# EAGLE schematic rokit (EAGLE 6.4)
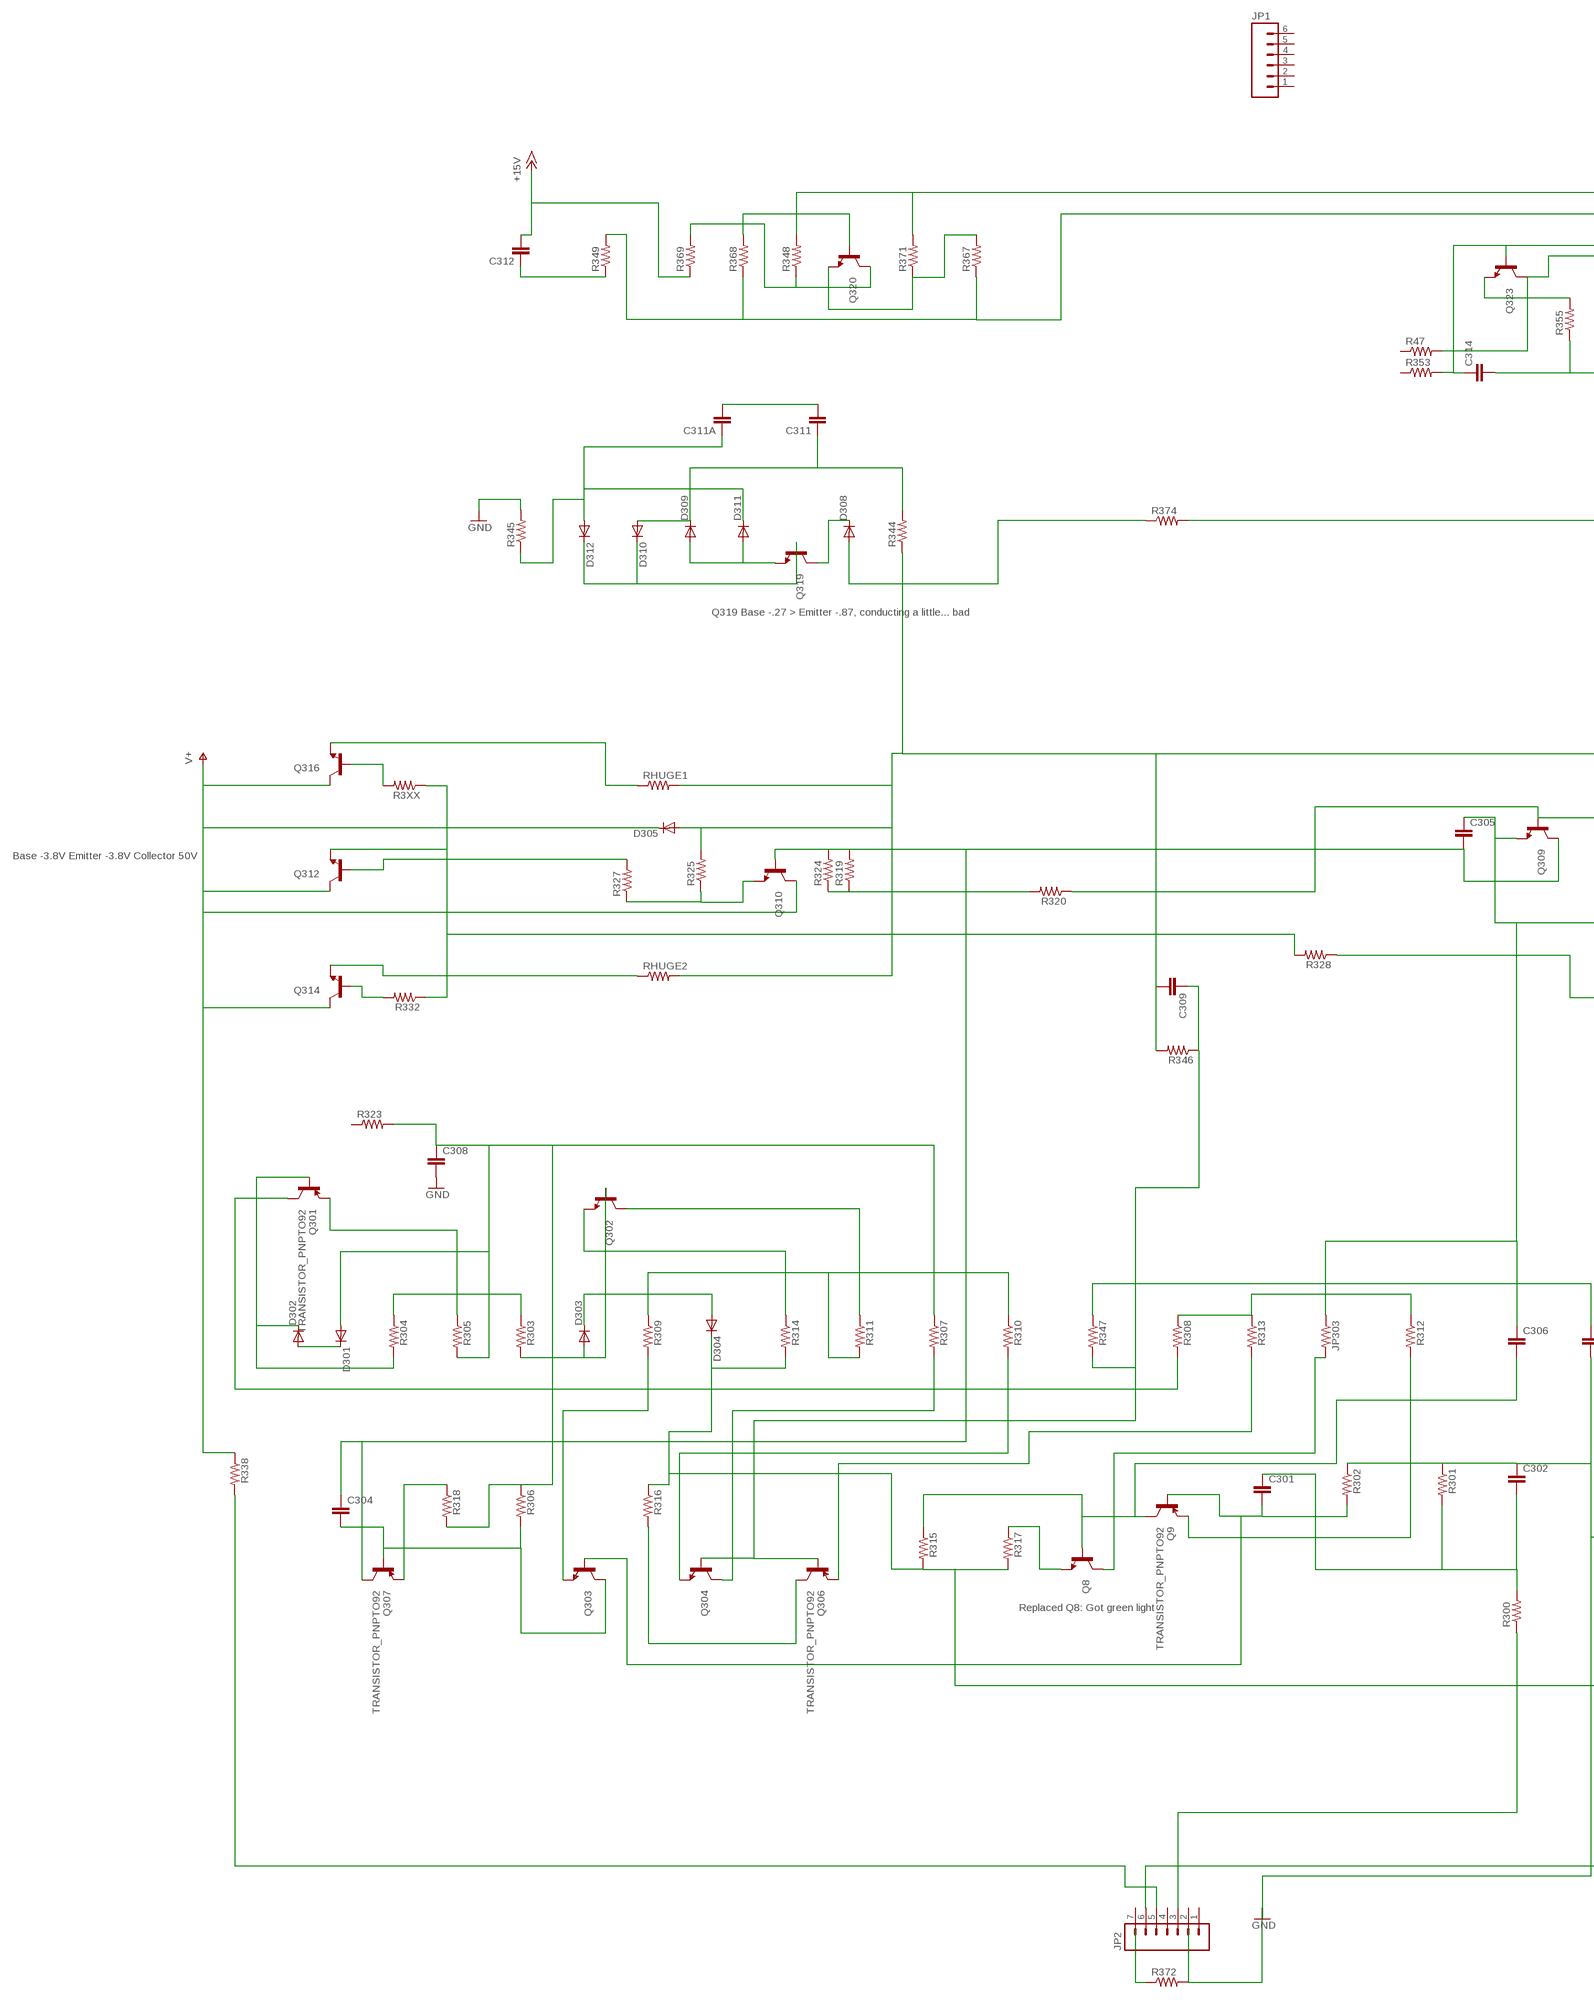
[diagram p0: schematic, sheet 1, part 1 of 2]
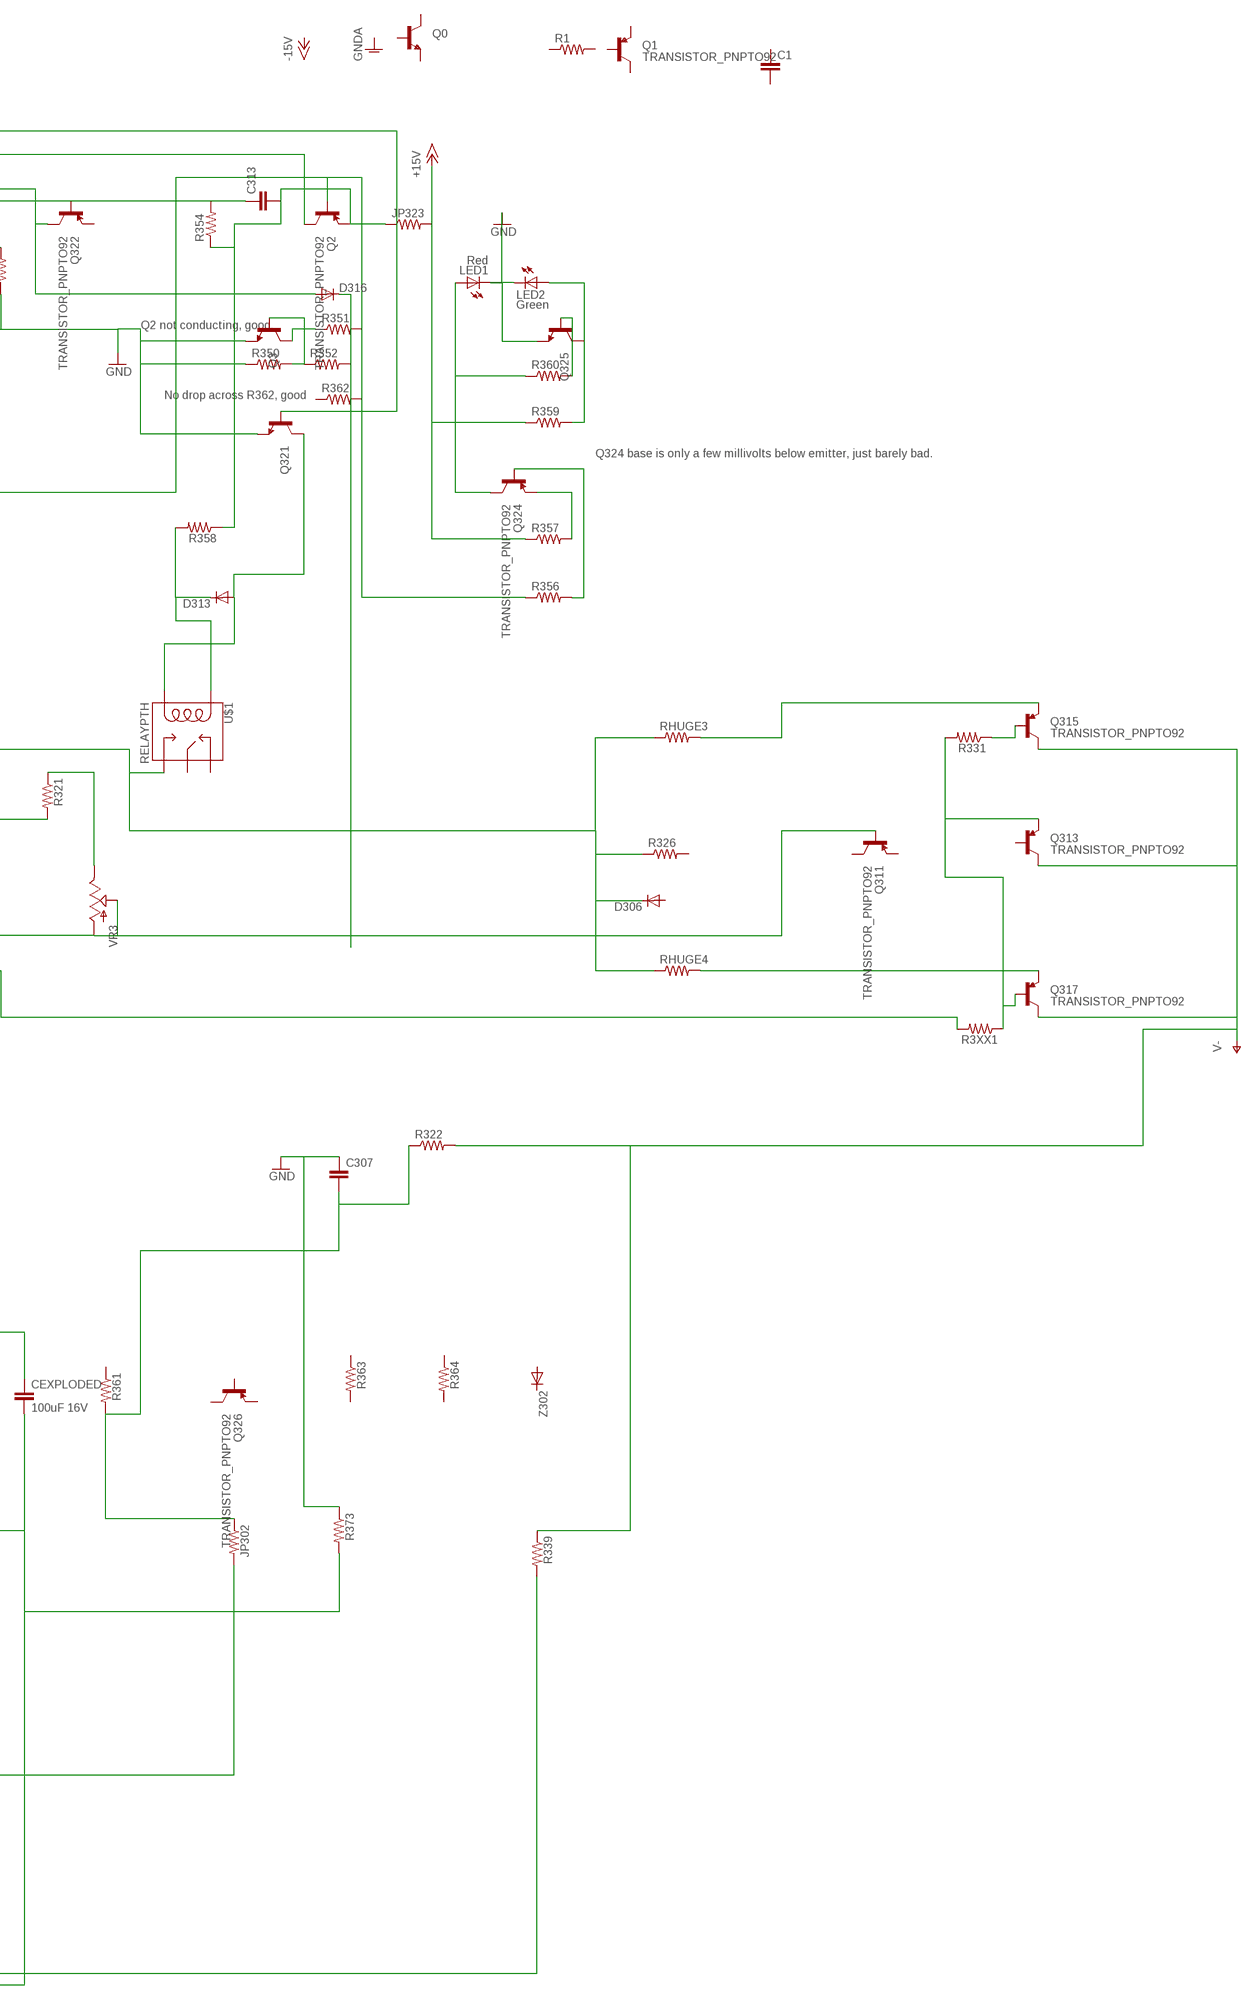
[diagram p1: schematic, sheet 1, part 2 of 2]

## Parts
C1  CAPPTH  [CAP-PTH-SMALL]
C301  CAPPTH  [CAP-PTH-SMALL]
C302  CAPPTH  [CAP-PTH-SMALL]
C304  CAPPTH  [CAP-PTH-SMALL]
C305  CAPPTH  [CAP-PTH-SMALL]
C306  CAPPTH  [CAP-PTH-SMALL]
C307  CAPPTH  [CAP-PTH-SMALL]
C308  CAPPTH  [CAP-PTH-SMALL]
C309  CAPPTH  [CAP-PTH-SMALL]
C311  CAPPTH  [CAP-PTH-SMALL]
C311A  CAPPTH  [CAP-PTH-SMALL]
C312  CAPPTH  [CAP-PTH-SMALL]
C313  CAPPTH  [CAP-PTH-SMALL]
C314  CAPPTH  [CAP-PTH-SMALL]
CEXPLODED  100uF 16V  CAPPTH  [CAP-PTH-SMALL]
D301  DIODE1N4148  [DIODE-1N4148]
D302  DIODE1N4148  [DIODE-1N4148]
D303  DIODE1N4148  [DIODE-1N4148]
D304  DIODE1N4148  [DIODE-1N4148]
D305  DIODE1N4148  [DIODE-1N4148]
D306  DIODE1N4148  [DIODE-1N4148]
D308  DIODE1N4148  [DIODE-1N4148]
D309  DIODE1N4148  [DIODE-1N4148]
D310  DIODE1N4148  [DIODE-1N4148]
D311  DIODE1N4148  [DIODE-1N4148]
D312  DIODE1N4148  [DIODE-1N4148]
D313  DIODE1N4148  [DIODE-1N4148]
D316  DIODE1N4148  [DIODE-1N4148]
JP1  M06LONGPADS  [1X06_LONGPADS]
JP2  M07  [1X07]
JP302  RESISTORPTH-1/4W  [AXIAL-0.4]
JP303  RESISTORPTH-1/4W  [AXIAL-0.4]
JP323  RESISTORPTH-1/4W  [AXIAL-0.4]
LED1  Red  LED5MM  [LED5MM]
LED2  Green  LED5MM  [LED5MM]
Q0  TRANSISTOR_NPNTO92  [TO-92]
Q1  TRANSISTOR_PNPTO92  [TO-92]
Q2  TRANSISTOR_PNPTO92  [TO-92]
Q3  TRANSISTOR_NPNTO92  [TO-92]
Q8  TRANSISTOR_NPNTO92  [TO-92]
Q9  TRANSISTOR_PNPTO92  [TO-92]
Q301  TRANSISTOR_PNPTO92  [TO-92]
Q302  TRANSISTOR_NPNTO92  [TO-92]
Q303  TRANSISTOR_NPNTO92  [TO-92]
Q304  TRANSISTOR_NPNTO92  [TO-92]
Q306  TRANSISTOR_PNPTO92  [TO-92]
Q307  TRANSISTOR_PNPTO92  [TO-92]
Q309  TRANSISTOR_NPNTO92  [TO-92]
Q310  TRANSISTOR_NPNTO92  [TO-92]
Q311  TRANSISTOR_PNPTO92  [TO-92]
Q312  TRANSISTOR_NPNTO92  [TO-92]
Q313  TRANSISTOR_PNPTO92  [TO-92]
Q314  TRANSISTOR_NPNTO92  [TO-92]
Q315  TRANSISTOR_PNPTO92  [TO-92]
Q316  TRANSISTOR_NPNTO92  [TO-92]
Q317  TRANSISTOR_PNPTO92  [TO-92]
Q319  TRANSISTOR_NPNTO92  [TO-92]
Q320  TRANSISTOR_NPNTO92  [TO-92]
Q321  TRANSISTOR_NPNTO92  [TO-92]
Q322  TRANSISTOR_PNPTO92  [TO-92]
Q323  TRANSISTOR_NPNTO92  [TO-92]
Q324  TRANSISTOR_PNPTO92  [TO-92]
Q325  TRANSISTOR_NPNTO92  [TO-92]
Q326  TRANSISTOR_PNPTO92  [TO-92]
R1  RESISTORPTH-1/4W  [AXIAL-0.4]
R3XX  RESISTORPTH-1/4W  [AXIAL-0.4]
R3XX1  RESISTORPTH-1/4W  [AXIAL-0.4]
R47  RESISTORPTH-1/4W  [AXIAL-0.4]
R300  RESISTORPTH-1/4W  [AXIAL-0.4]
R301  RESISTORPTH-1/4W  [AXIAL-0.4]
R302  RESISTORPTH-1/4W  [AXIAL-0.4]
R303  RESISTORPTH-1/4W  [AXIAL-0.4]
R304  RESISTORPTH-1/4W  [AXIAL-0.4]
R305  RESISTORPTH-1/4W  [AXIAL-0.4]
R306  RESISTORPTH-1/4W  [AXIAL-0.4]
R307  RESISTORPTH-1/4W  [AXIAL-0.4]
R308  RESISTORPTH-1/4W  [AXIAL-0.4]
R309  RESISTORPTH-1/4W  [AXIAL-0.4]
R310  RESISTORPTH-1/4W  [AXIAL-0.4]
R311  RESISTORPTH-1/4W  [AXIAL-0.4]
R312  RESISTORPTH-1/4W  [AXIAL-0.4]
R313  RESISTORPTH-1/4W  [AXIAL-0.4]
R314  RESISTORPTH-1/4W  [AXIAL-0.4]
R315  RESISTORPTH-1/4W  [AXIAL-0.4]
R316  RESISTORPTH-1/4W  [AXIAL-0.4]
R317  RESISTORPTH-1/4W  [AXIAL-0.4]
R318  RESISTORPTH-1/4W  [AXIAL-0.4]
R319  RESISTORPTH-1/4W  [AXIAL-0.4]
R320  RESISTORPTH-1/4W  [AXIAL-0.4]
R321  RESISTORPTH-1/4W  [AXIAL-0.4]
R322  RESISTORPTH-1/4W  [AXIAL-0.4]
R323  RESISTORPTH-1/4W  [AXIAL-0.4]
R324  RESISTORPTH-1/4W  [AXIAL-0.4]
R325  RESISTORPTH-1/4W  [AXIAL-0.4]
R326  RESISTORPTH-1/4W  [AXIAL-0.4]
R327  RESISTORPTH-1/4W  [AXIAL-0.4]
R328  RESISTORPTH-1/4W  [AXIAL-0.4]
R331  RESISTORPTH-1/4W  [AXIAL-0.4]
R332  RESISTORPTH-1/4W  [AXIAL-0.4]
R338  RESISTORPTH-1/4W  [AXIAL-0.4]
R339  RESISTORPTH-1/4W  [AXIAL-0.4]
R344  RESISTORPTH-1/4W  [AXIAL-0.4]
R345  RESISTORPTH-1/4W  [AXIAL-0.4]
R346  RESISTORPTH-1/4W  [AXIAL-0.4]
R347  RESISTORPTH-1/4W  [AXIAL-0.4]
R348  RESISTORPTH-1/4W  [AXIAL-0.4]
R349  RESISTORPTH-1/4W  [AXIAL-0.4]
R350  RESISTORPTH-1/4W  [AXIAL-0.4]
R351  RESISTORPTH-1/4W  [AXIAL-0.4]
R352  RESISTORPTH-1/4W  [AXIAL-0.4]
R353  RESISTORPTH-1/4W  [AXIAL-0.4]
R354  RESISTORPTH-1/4W  [AXIAL-0.4]
R355  RESISTORPTH-1/4W  [AXIAL-0.4]
R356  RESISTORPTH-1/4W  [AXIAL-0.4]
R357  RESISTORPTH-1/4W  [AXIAL-0.4]
R358  RESISTORPTH-1/4W  [AXIAL-0.4]
R359  RESISTORPTH-1/4W  [AXIAL-0.4]
R360  RESISTORPTH-1/4W  [AXIAL-0.4]
R361  RESISTORPTH-1/4W  [AXIAL-0.4]
R362  RESISTORPTH-1/4W  [AXIAL-0.4]
R363  RESISTORPTH-1/4W  [AXIAL-0.4]
R364  RESISTORPTH-1/4W  [AXIAL-0.4]
R367  RESISTORPTH-1/4W  [AXIAL-0.4]
R368  RESISTORPTH-1/4W  [AXIAL-0.4]
R369  RESISTORPTH-1/4W  [AXIAL-0.4]
R371  RESISTORPTH-1/4W  [AXIAL-0.4]
R372  RESISTORPTH-1/4W  [AXIAL-0.4]
R373  RESISTORPTH-1/4W  [AXIAL-0.4]
R374  RESISTORPTH-1/4W  [AXIAL-0.4]
RHUGE1  RESISTORPTH-1/4W  [AXIAL-0.4]
RHUGE2  RESISTORPTH-1/4W  [AXIAL-0.4]
RHUGE3  RESISTORPTH-1/4W  [AXIAL-0.4]
RHUGE4  RESISTORPTH-1/4W  [AXIAL-0.4]
U$1  RELAYPTH  [RELAY-G5Q]
VR3  POTTRIM  [TRIM_POT]
Z302  DIODE1N4148  [DIODE-1N4148]

## Nets
+15V: C312.2 JP323.P$2 R357.P$1 R359.P$1 R369.P$1
GND: C302.1 C307.1 C308.2 C314.2 CEXPLODED.2 LED1.K(C) LED2.K(C) Q3.1(E) Q321.1(E) Q325.1(E) R301.P$1 R302.P$1 R345.P$2 R350.P$1 R355.P$1 R372.P$2 R373.P$1 R373.P$2
N$1: LED2.A Q325.3(C) R359.P$2
N$2: Q325.2(B) R360.P$2
N$3: LED1.A Q324.3(C) R360.P$1
N$4: Q324.1(E) R357.P$2
N$5: Q324.2(B) R356.P$2
N$6: Q2.2(B) R351.P$2 R356.P$1 R362.P$2 R374.P$2
N$7: C313.2 JP323.P$1 Q2.1(E) R354.P$1 R358.P$1
N$8: C313.1 Q322.2(B) Q323.3(C) R47.P$2 R354.P$2
N$9: C314.1 D316.A Q322.3(C) Q323.2(B) R353.P$2
N$10: Q2.3(C) R349.P$2 R367.P$1 R368.P$1
N$11: D308.A R374.P$1
N$12: D308.C Q319.3(C)
N$13: D309.A D311.A Q319.1(E)
N$14: D310.C D312.C Q319.2(B)
N$15: C311A.1 D311.C D312.A R345.P$1
N$16: Q3.3(C) R351.P$1
N$17: C311.2 C311A.2
N$18: Q3.2(B) R350.P$2 R352.P$1
N$19: C311.1 D309.C D310.A R344.P$2
N$20: D316.C R352.P$2
N$21: Q323.1(E) R355.P$2
N$22: D313.A Q321.3(C) U$1.1(COIL2)
N$23: D313.C R358.P$2 U$1.5(COIL1)
N$24: Q321.2(B) R348.P$2 R371.P$2
N$25: Q320.3(C) R348.P$1 R369.P$2
N$26: Q320.2(B) R368.P$2
N$27: C312.1 R349.P$1
N$28: Q320.1(E) R367.P$2 R371.P$1
N$29: C309.2 D305.A D306.C R325.P$2 R326.P$1 R344.P$1 R346.P$2 RHUGE1.P$2 RHUGE2.P$2 RHUGE3.P$1 RHUGE4.P$1 U$1.3(NO)
N$30: C309.1 Q304.2(B) Q306.2(B) R346.P$1 R347.P$2
N$31: CEXPLODED.1 R347.P$1
N$32: R372.P$1
N$33: Q304.3(C) R307.P$2
N$34: D302.C Q301.2(B) R304.P$2
N$35: C308.1 D301.A R305.P$2 R306.P$1 R307.P$1 R318.P$2 R323.P$2
N$36: R303.P$1 R304.P$1
N$37: D301.C D302.A
N$38: Q301.1(E) R305.P$1
N$39: D303.A Q302.2(B) R303.P$2
N$40: D303.C D304.A
N$41: Q301.3(C) R308.P$2
N$42: Q316.1(E) RHUGE1.P$1
N$43: Q314.1(E) RHUGE2.P$1
N$44: Q315.1(E) RHUGE3.P$2
N$45: Q317.1(E) RHUGE4.P$2
N$46: Q316.2(B) R3XX.P$2
N$47: Q312.1(E) R3XX.P$1 R328.P$2 R332.P$1
N$48: Q314.2(B) R332.P$2
N$49: R3XX1.P$2 R328.P$1
N$50: Q313.1(E) Q317.2(B) R3XX1.P$1 R331.P$2
N$51: Q315.2(B) R331.P$1
N$52: Q310.1(E) R325.P$1 R327.P$1
N$53: Q312.2(B) R327.P$2
N$54: C304.1 C305.2 Q307.3(C) Q309.3(C) Q310.2(B) R319.P$2 R324.P$2
N$55: R319.P$1 R320.P$2 R324.P$1
N$56: Q309.2(B) R320.P$1 R321.P$2
N$57: C306.2 Q8.2(B) Q9.3(C) R315.P$1
N$59: R321.P$1 VR3.2(E)
N$60: C304.2 Q303.3(C) Q307.2(B) R306.P$2
N$61: Q307.1(E) R318.P$1
N$62: Q303.1(E) R309.P$2
N$63: C301.2 Q9.2(B) Q303.2(B) R302.P$2
N$64: Q306.3(C) R316.P$2
N$65: Q304.1(E) R310.P$2
N$66: D304.C JP302.P$2 R314.P$2 R315.P$2 R316.P$1 R317.P$2
N$67: Q8.1(E) R317.P$1
N$68: JP303.P$2 Q8.3(C)
N$69: Q9.1(E) R312.P$2
N$70: Q306.1(E) R313.P$2
N$71: C301.1 C302.2 R300.P$2 R301.P$2
N$72: JP2.3 R300.P$1
N$73: C307.2 JP302.P$1 R322.P$1 R361.P$2
N$74: JP2.6 R339.P$2
N$75: JP2.5 R338.P$2
N$76: R309.P$1 R310.P$1 R311.P$2
N$77: Q302.1(E) R314.P$1
N$78: Q302.3(C) R311.P$1
N$79: R308.P$1 R312.P$1 R313.P$1
N$80: C305.1 C306.1 JP303.P$1 Q309.1(E) Q311.2(B) VR3.1(S) VR3.3(A)
V+: D305.C Q310.3(C) Q312.3(C) Q314.3(C) Q316.3(C) R338.P$1
V-: Q313.3(C) Q315.3(C) Q317.3(C) R322.P$2 R339.P$1
Unconnected: C1.1 C1.2 D306.A JP1.1 JP1.2 JP1.3 JP1.4 JP1.5 JP1.6 JP2.1 JP2.2 JP2.4 JP2.7 Q0.1(E) Q0.2(B) Q0.3(C) Q1.1(E) Q1.2(B) Q1.3(C) Q311.1(E) Q311.3(C) Q313.2(B) Q322.1(E) Q326.1(E) Q326.2(B) Q326.3(C) R1.P$1 R1.P$2 R47.P$1 R323.P$1 R326.P$2 R353.P$1 R361.P$1 R362.P$1 R363.P$1 R363.P$2 R364.P$1 R364.P$2 U$1.2(MAIN) U$1.4(NC) Z302.A Z302.C

## Notes on the sheet
- Q2 not conducting, good.
- No drop across R362, good
- Q324 base is only a few millivolts below emitter, just barely bad.
- Q319 Base -.27 > Emitter -.87, conducting a little... bad
- Base -3.8V Emitter -3.8V Collector 50V
- Replaced Q8: Got green light

## Library data of the parts
C1 C301 C302 C304-C309 C311 C311A C312-C314 CEXPLODED = SparkFun:CAP: Capacitor Standard 0603 ceramic capacitor, and 0.1" leaded capacitor.
D301-D306 D308-D313 D316 Z302 = SparkFun:DIODE: Diode These are standard reverse protection diodes and small signal diodes. SMA package can handle up to about 1A. SOD-323 can handle about 200mA. What the SOD-323 package when ordering, there are some mfgs out there that are 5-pin packages.
JP1 = SparkFun:M06: Header 6 Standard 6-pin 0.1" header. Use with straight break away headers (SKU : PRT-00116), right angle break away headers (PRT-00553), swiss pins (PRT-00743), machine pins (PRT-00117), and female headers (PRT-00115). Molex polarized connector foot print use with SKU : PRT-08094 with associated crimp pins and housings. NOTES ON THE VARIANTS LOCK and LOCK_LONGPADS... This footprint was designed to help hold the alignment of a through-hole component (i.e. 6-pin header) while soldering it into place. You may notice that each hole has been shifted either up or down by 0.005 of an inch from it's more standard position (which is a perfectly straight line). This slight alteration caused the pins (the squares in the middle) to touch the edges of the holes. Because they are alternating, it causes a "brace" to hold the component in place. 0.005 has proven to be the perfect amount of "off-center" position when using our standard breakaway headers. Although looks a little odd when you look at the bare footprint, once you have a header in there, the alteration is very hard to notice. Also, if you push a header all the way into place, it is covered up entirely on the bottom side. This idea of altering the position of holes to aid alignment will be further integrated into the Sparkfun Library for other footprints. It can help hold any component with 3 or more connection pins.
JP2 = SparkFun:M07: Header 7 Standard 7-pin 0.1" header. Use with straight break away headers (SKU : PRT-00116), right angle break away headers (PRT-00553), swiss pins (PRT-00743), machine pins (PRT-00117), and female headers (PRT-00115). NOTES ON THE VARIANTS LOCK and LOCK_LONGPADS... This footprint was designed to help hold the alignment of a through-hole component (i.e. 7-pin header) while soldering it into place. You may notice that each hole has been shifted either up or down by 0.005 of an inch from it's more standard position (which is usually a perfectly straight line). This slight alteration caused the pins (the squares in the middle) to touch the edges of the holes. Because they are alternating, it causes a "brace" to hold the header in place. 0.005 has proven to be the perfect amount of "off-center" position when using our standard breakaway headers. Although looks a little odd when you look at the bare footprint, once you have a header in there, the alteration is very hard to notice. Also, if you push a header all the way into place, it is covered up entirely on the bottom side. This idea of altering the position of holes to aid alignment will be further integrated into the Sparkfun Library for other footprints. It can help hold any component with 3 or more connection pins.
JP302 JP303 JP323 R1 R3XX R3XX1 R47 R300-R328 R331 R332 R338 R339 R344-R364 R367-R369 R371-R374 RHUGE1-RHUGE4 = SparkFun:RESISTOR: Resistor Basic schematic elements and footprints for 0603, 1206, and PTH resistors.
LED1 LED2 = SparkFun:LED: LEDs Standard schematic elements and footprints for 5mm, 3mm, 1206, and 0603 sized LEDs. 5mm - Spark Fun Electronics SKU : COM-00529 (and others)
Q0 Q3 Q8 Q302-Q304 Q309 Q310 Q312 Q314 Q316 Q319-Q321 Q323 Q325 = SparkFun:TRANSISTOR_NPN: Transistor NPN BJT configuration in SOT23 package. MMBT2222 is the common NPN we use. Double check BCE configuration again layout.
Q1 Q2 Q9 Q301 Q306 Q307 Q311 Q313 Q315 Q317 Q322 Q324 Q326 = SparkFun:TRANSISTOR_PNP
U$1 = SparkFun:RELAY
VR3 = SparkFun:POT